# EasyEDA schematic SCH_RE2-YM2608 REV.0.1a_2023-12-15.json

## Sheets
1 OPNA: TITLE: Sheet_1; REV: 1.0; Date: 2023-12-15; Sheet: 1/1; Drawn By: Denjhang; Company: Your Company
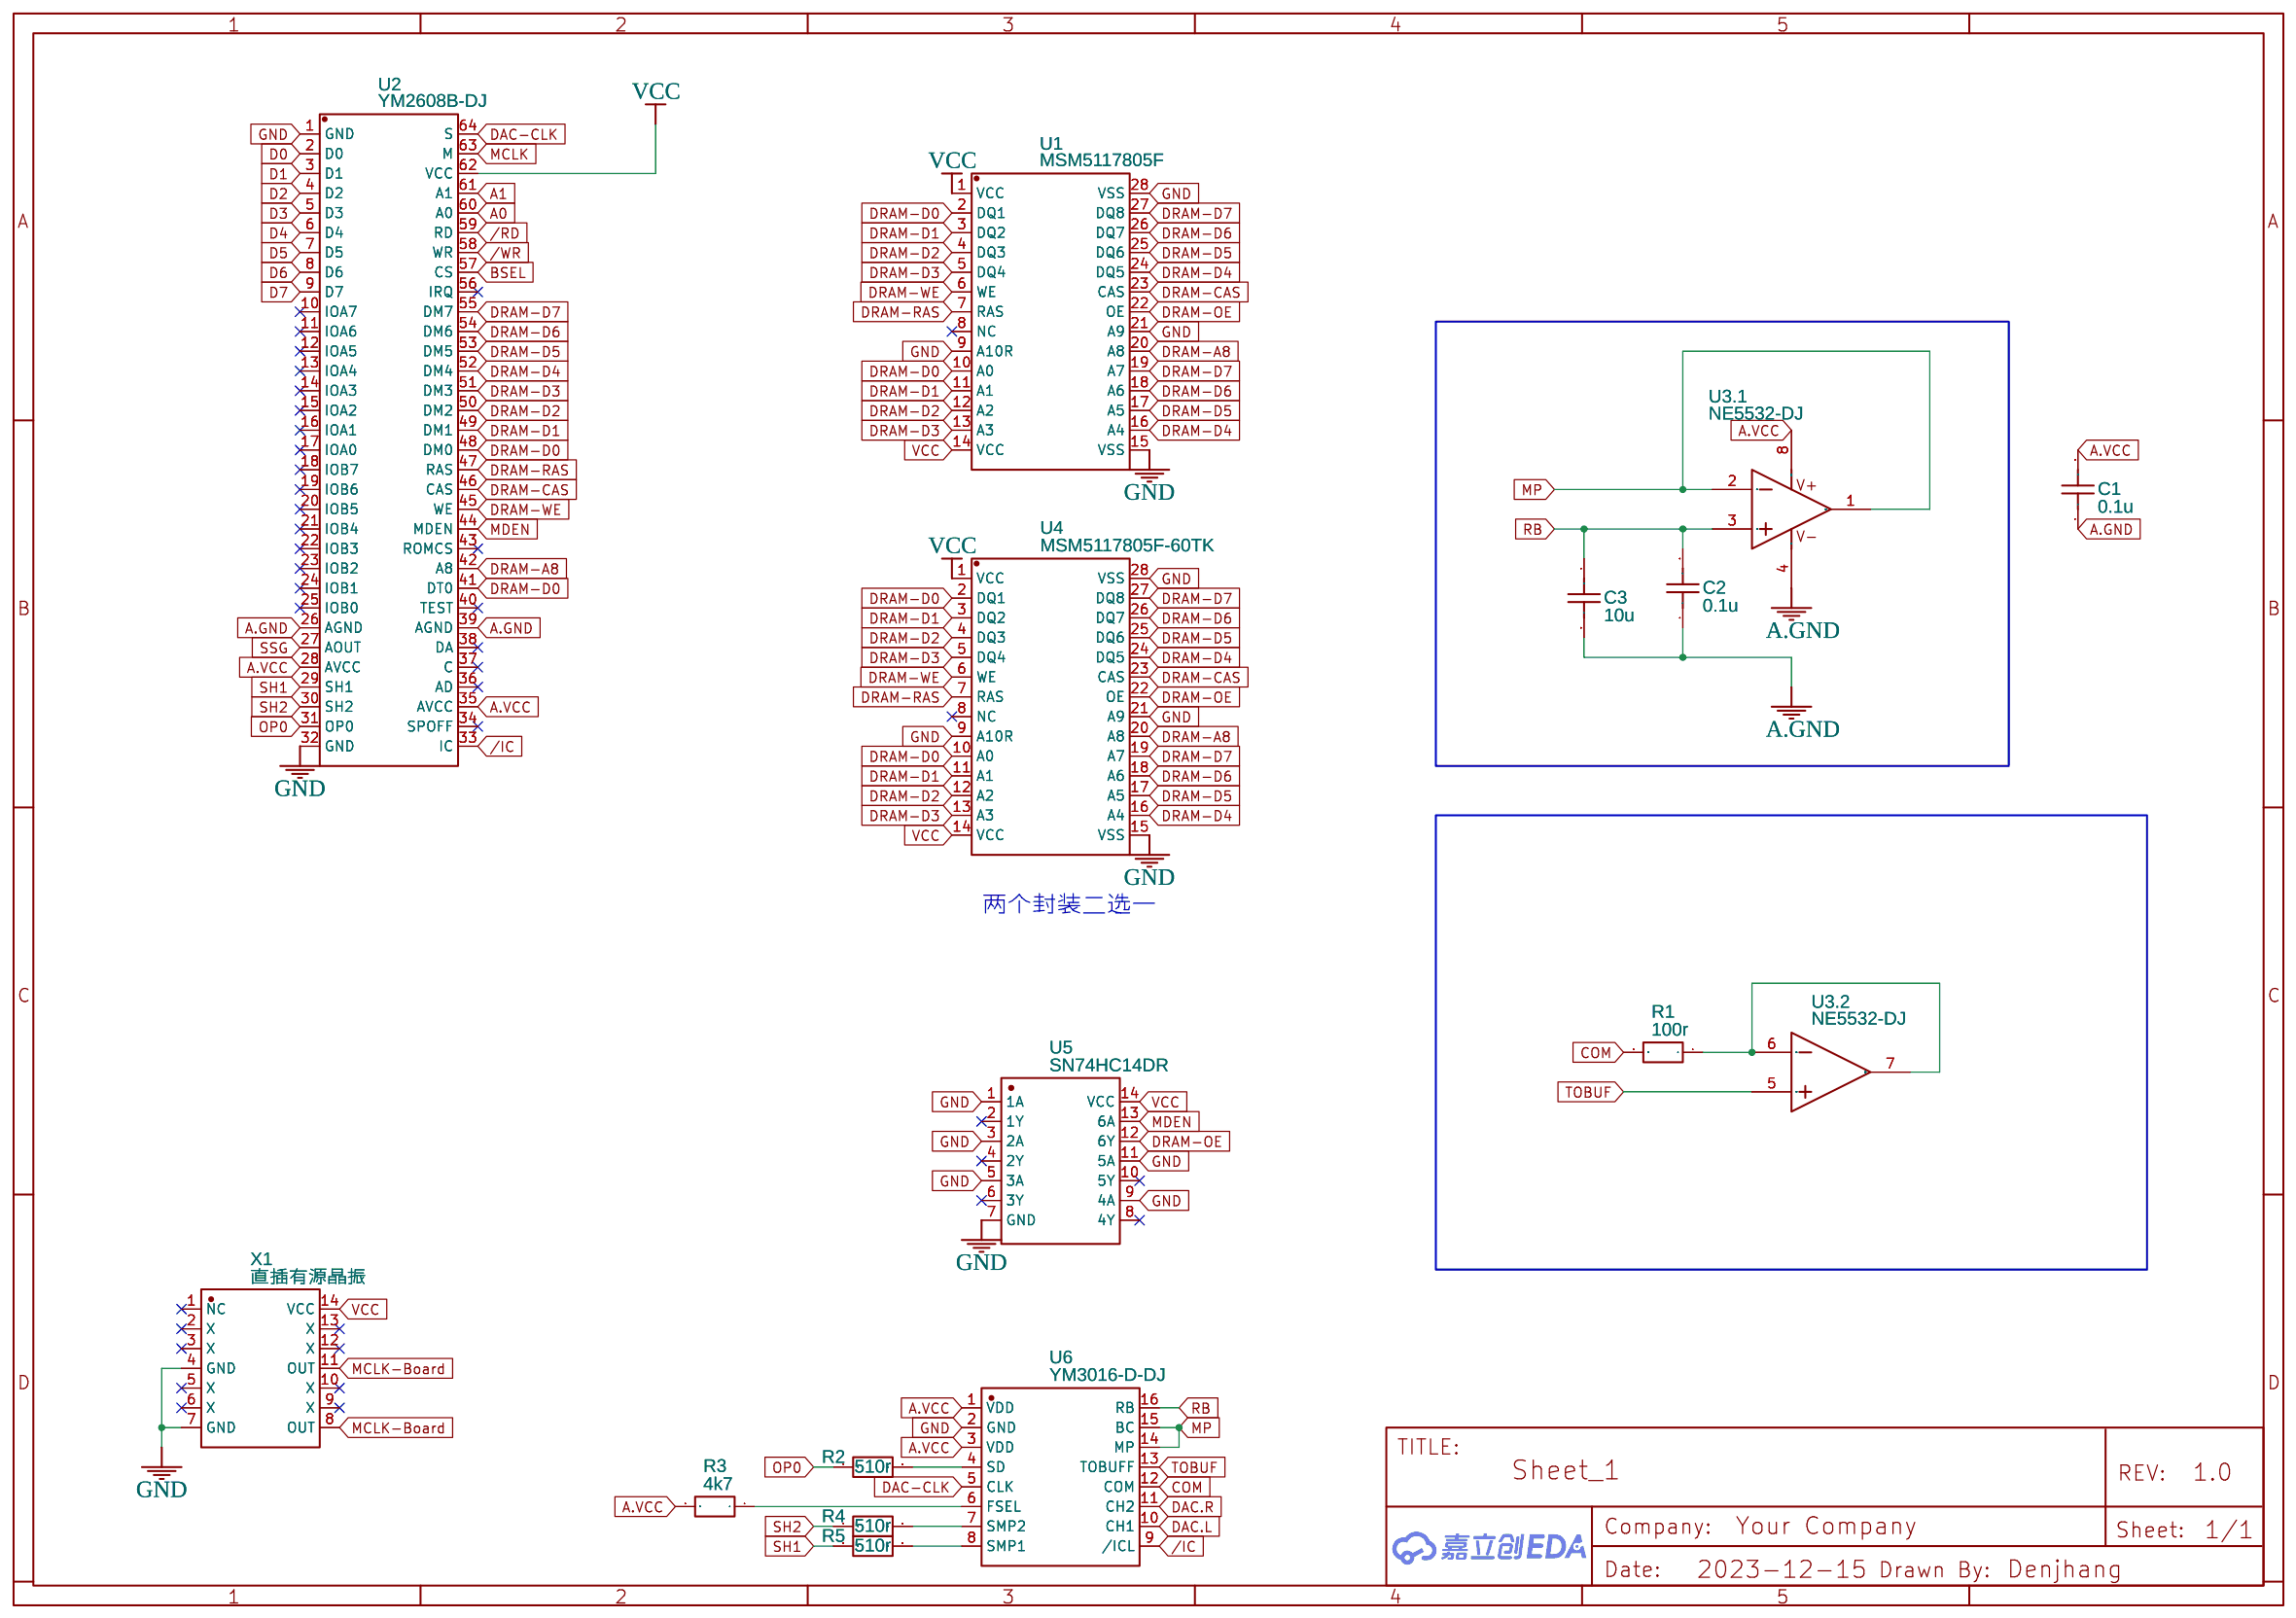
[diagram p0: OPNA]
2 BUS-PSU: TITLE: Sheet_2
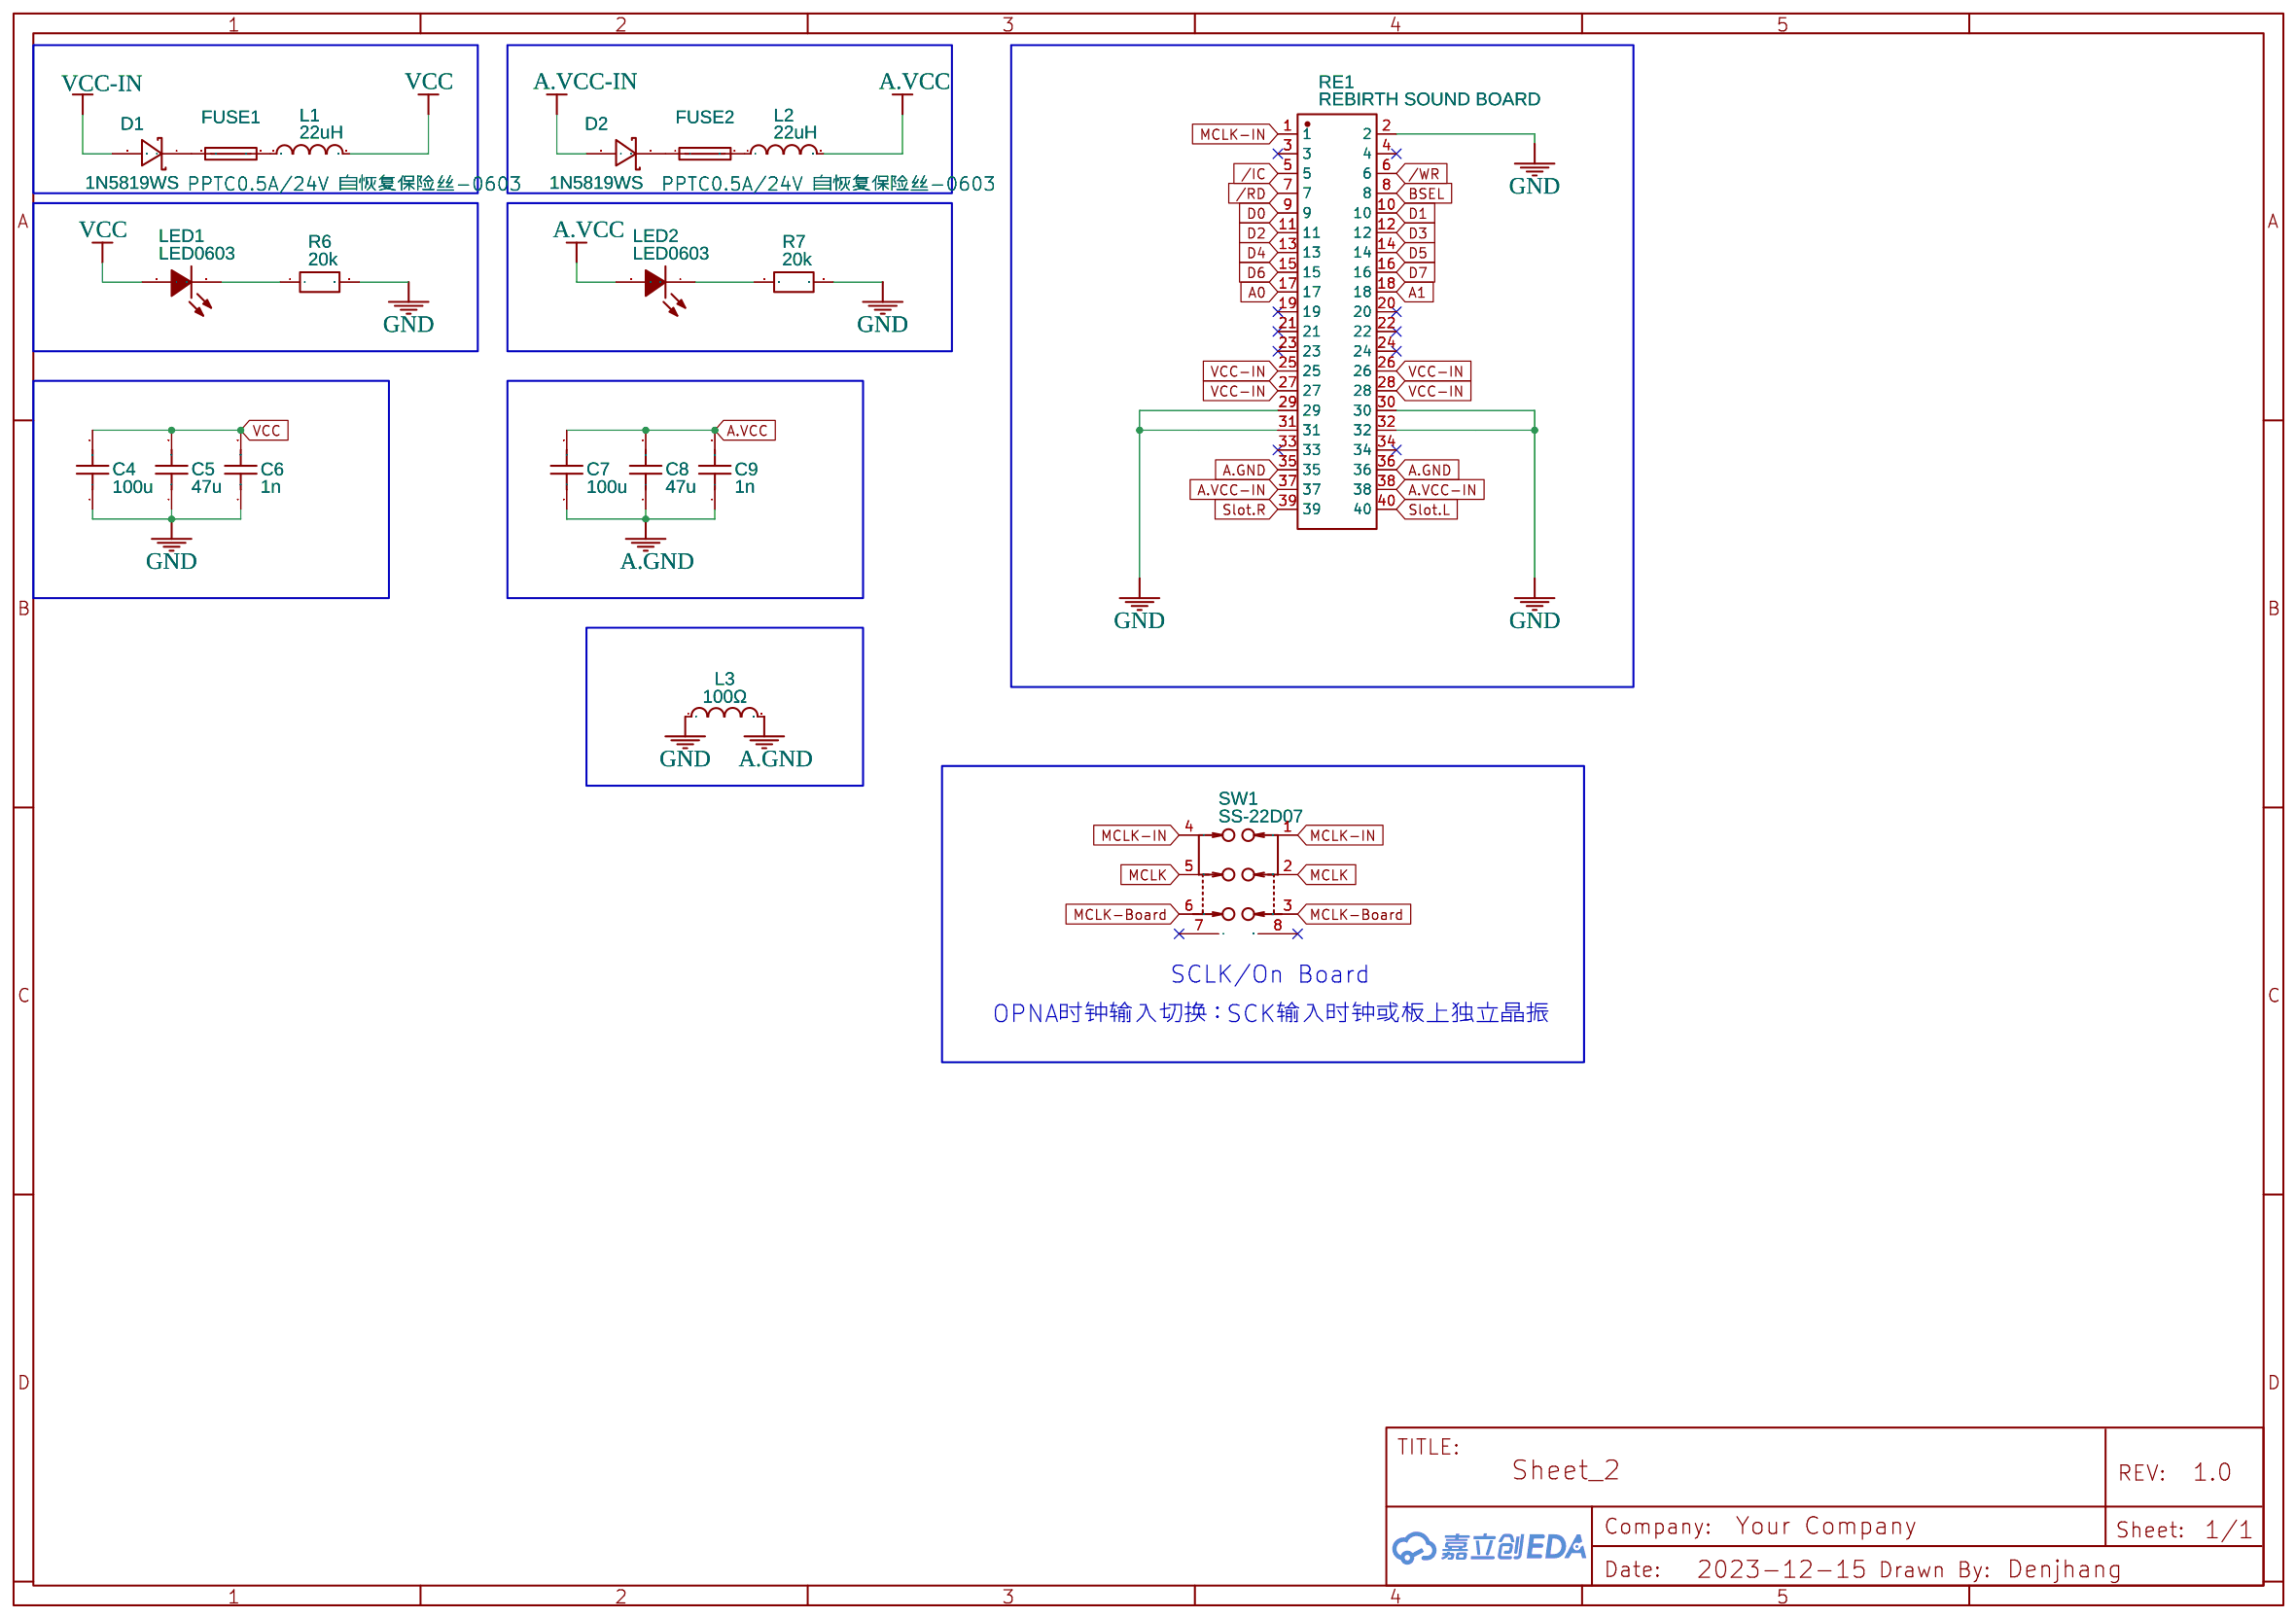
[diagram p1: BUS-PSU]
3 AMP-FM
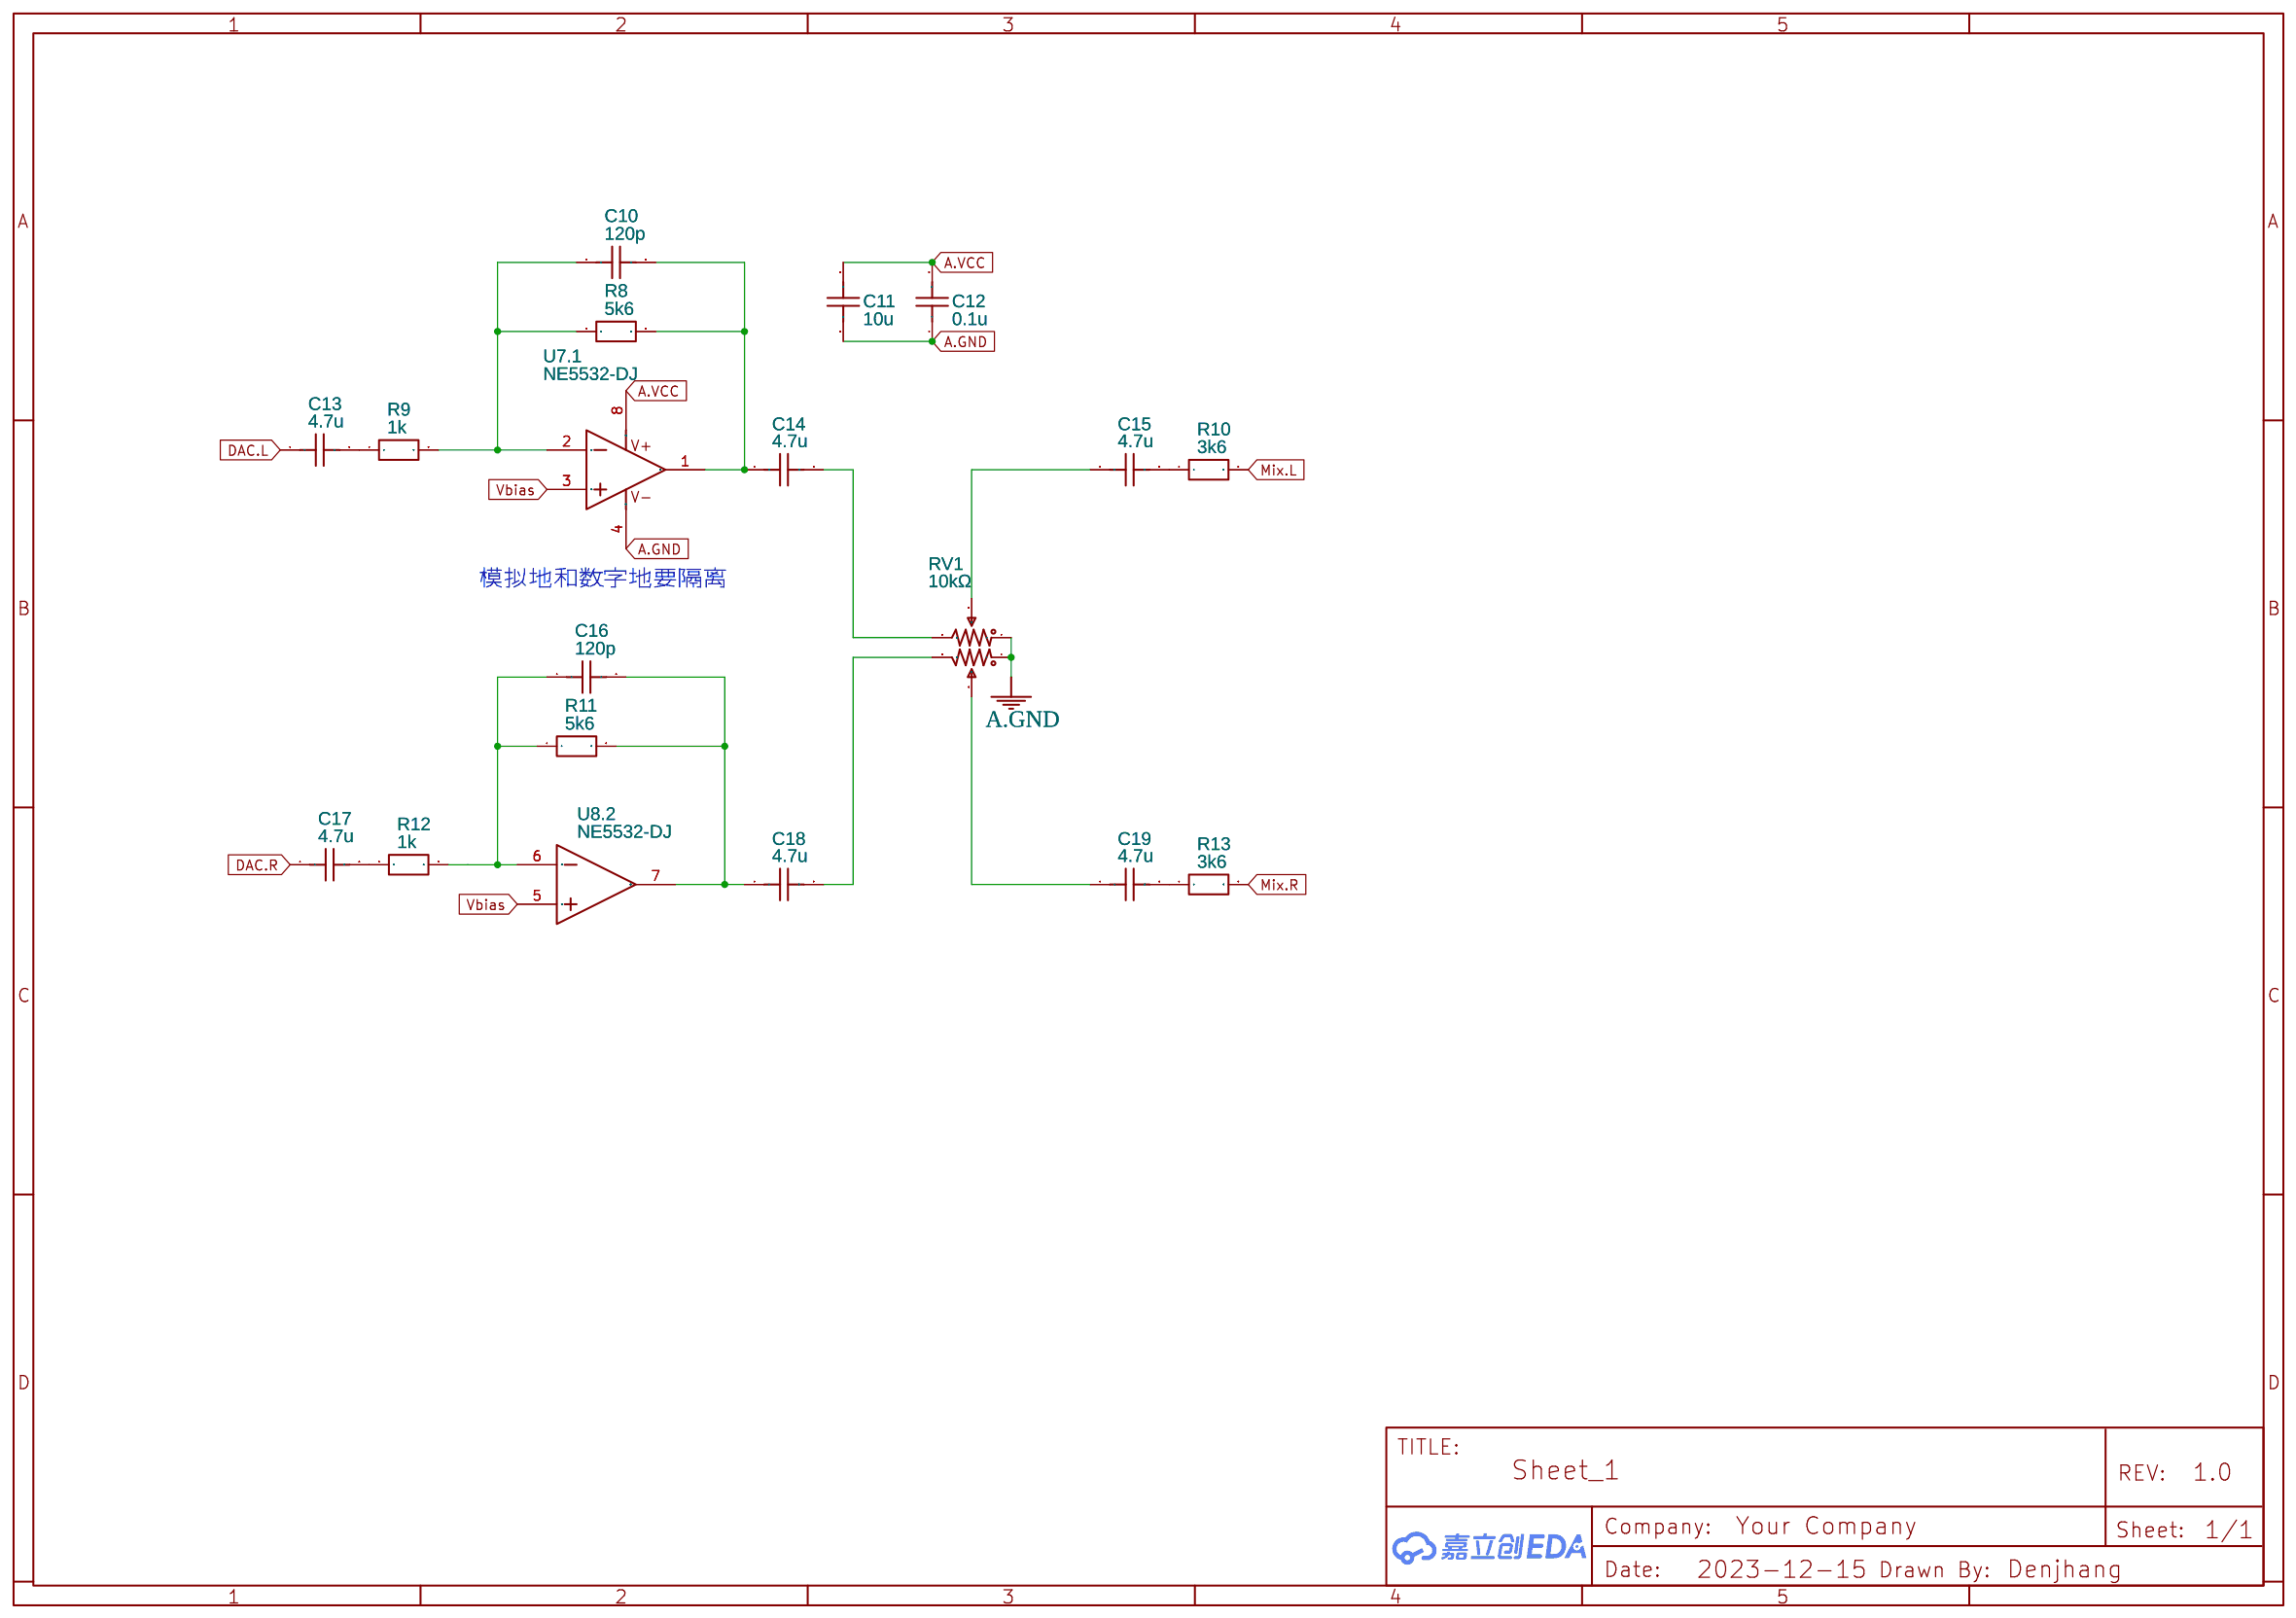
[diagram p2: AMP-FM]
4 AMP-SSG
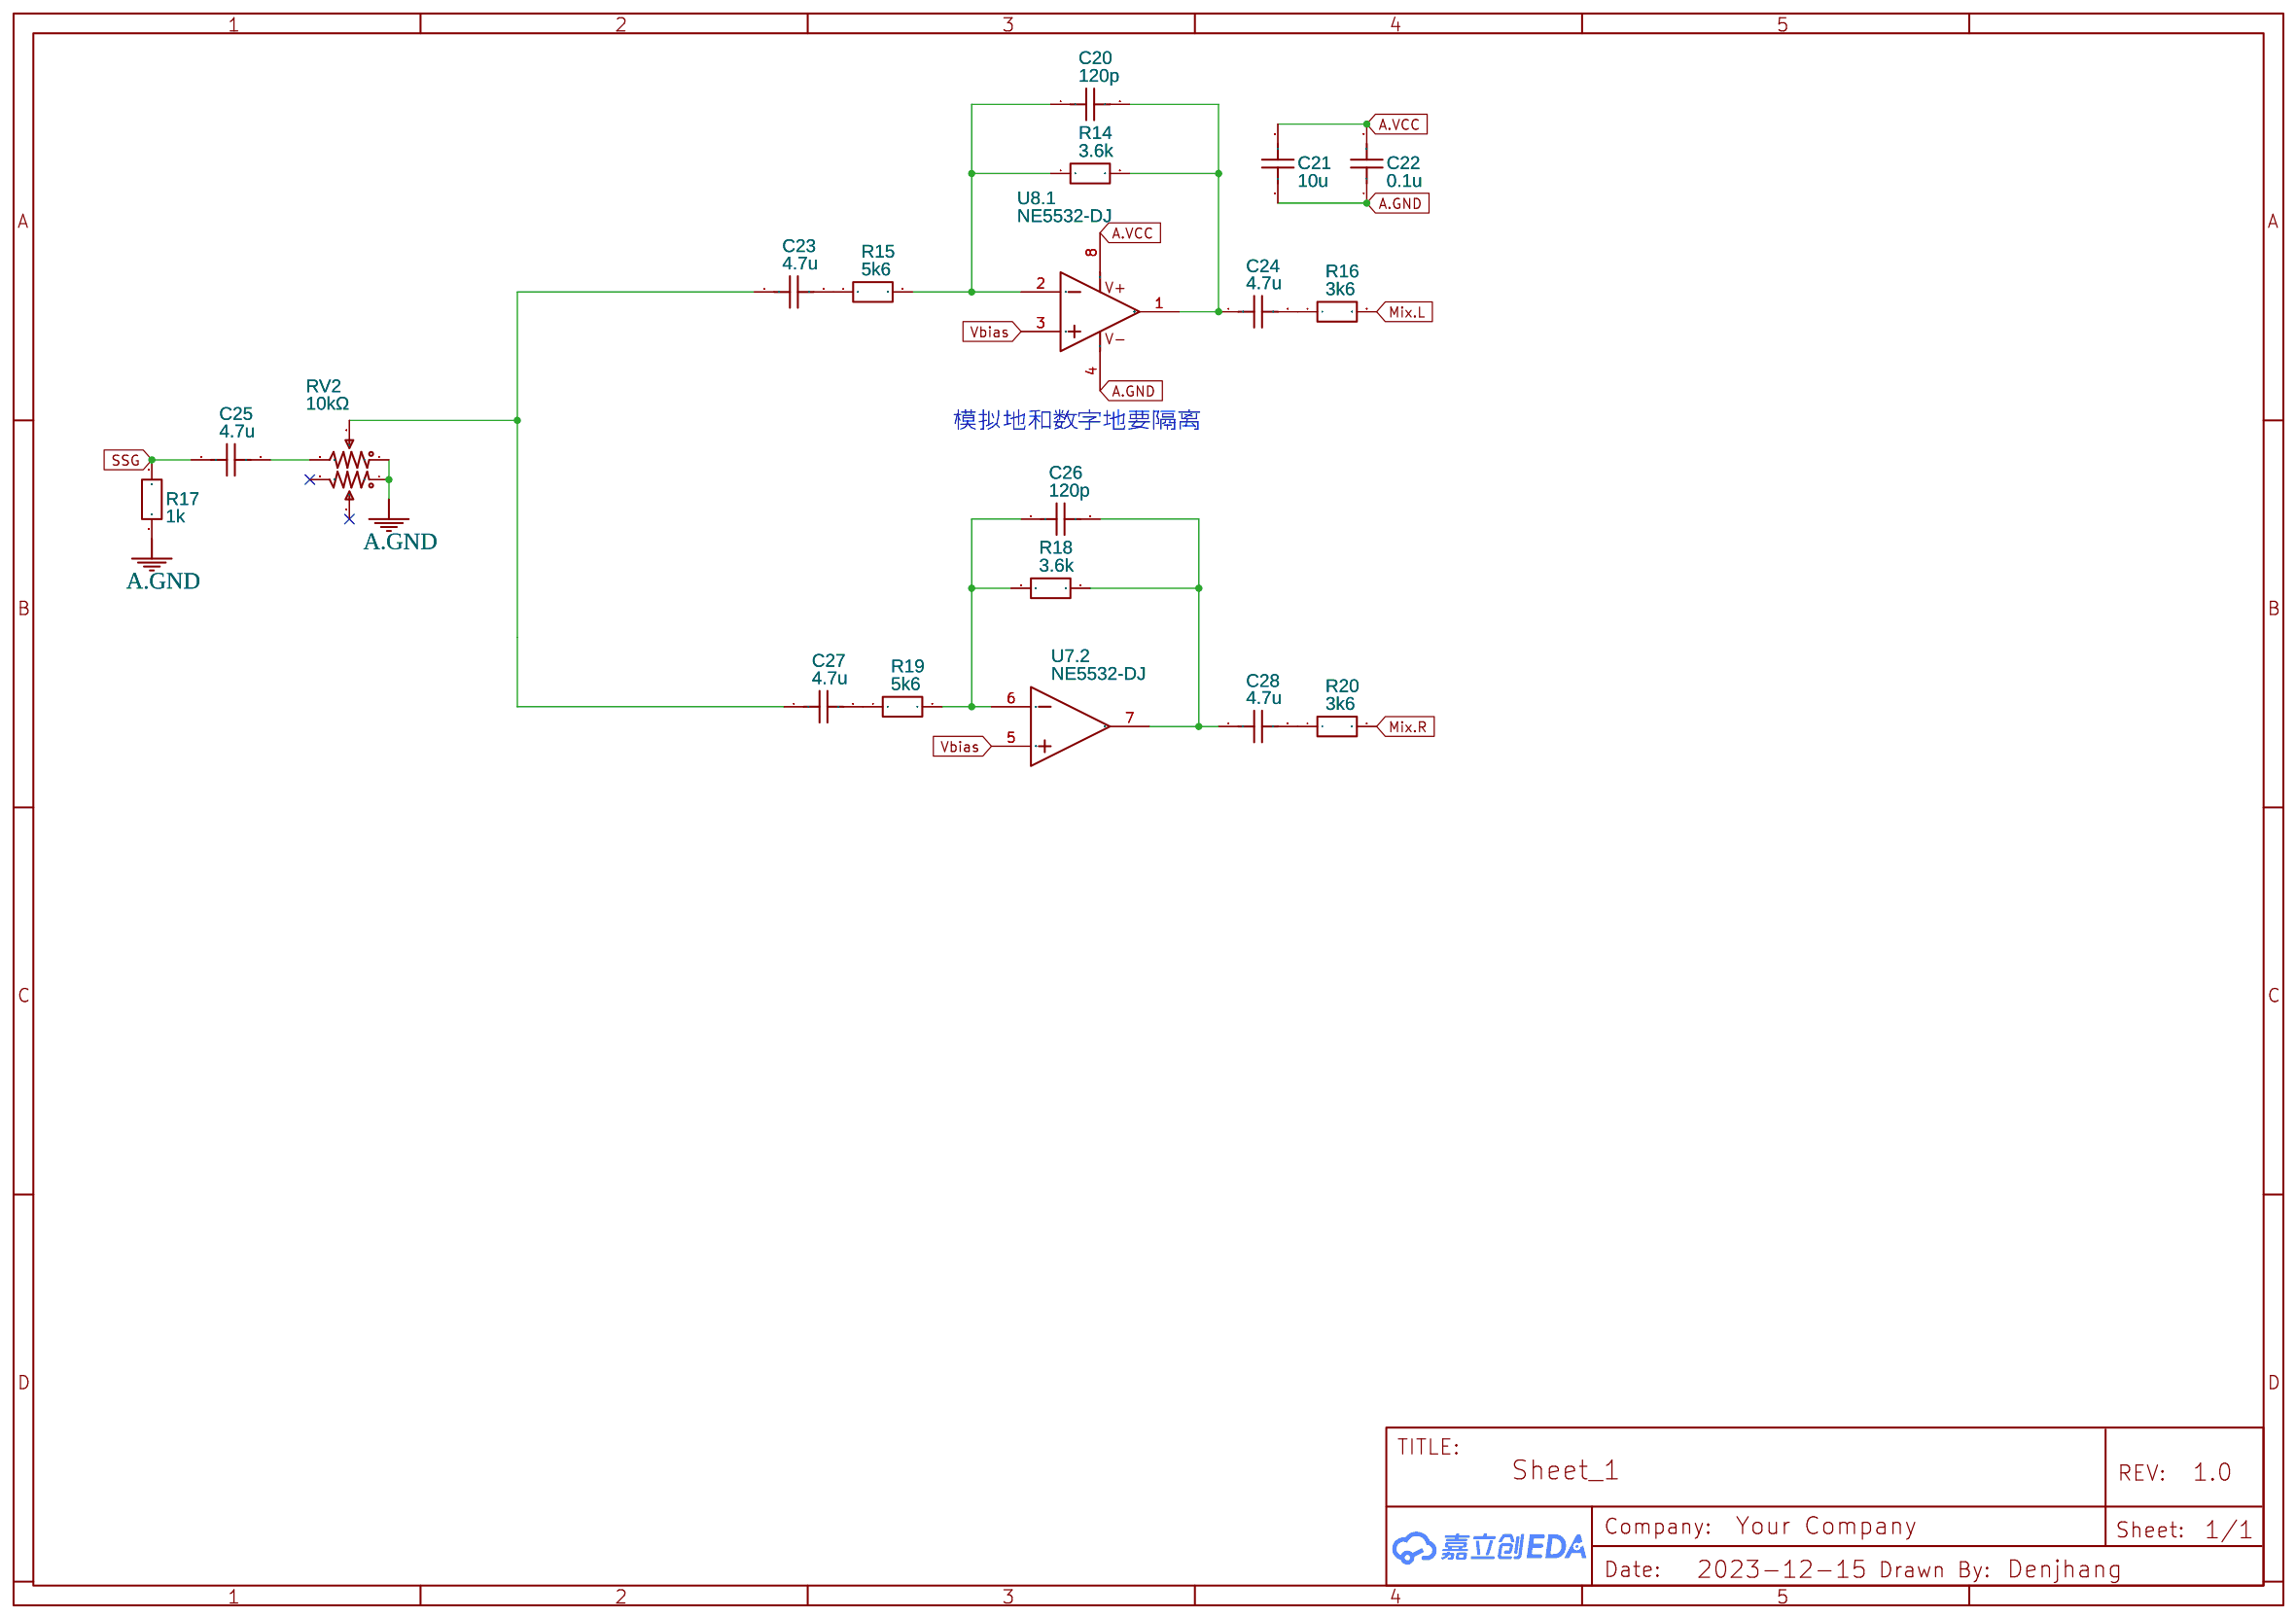
[diagram p3: AMP-SSG]
5 Mixer
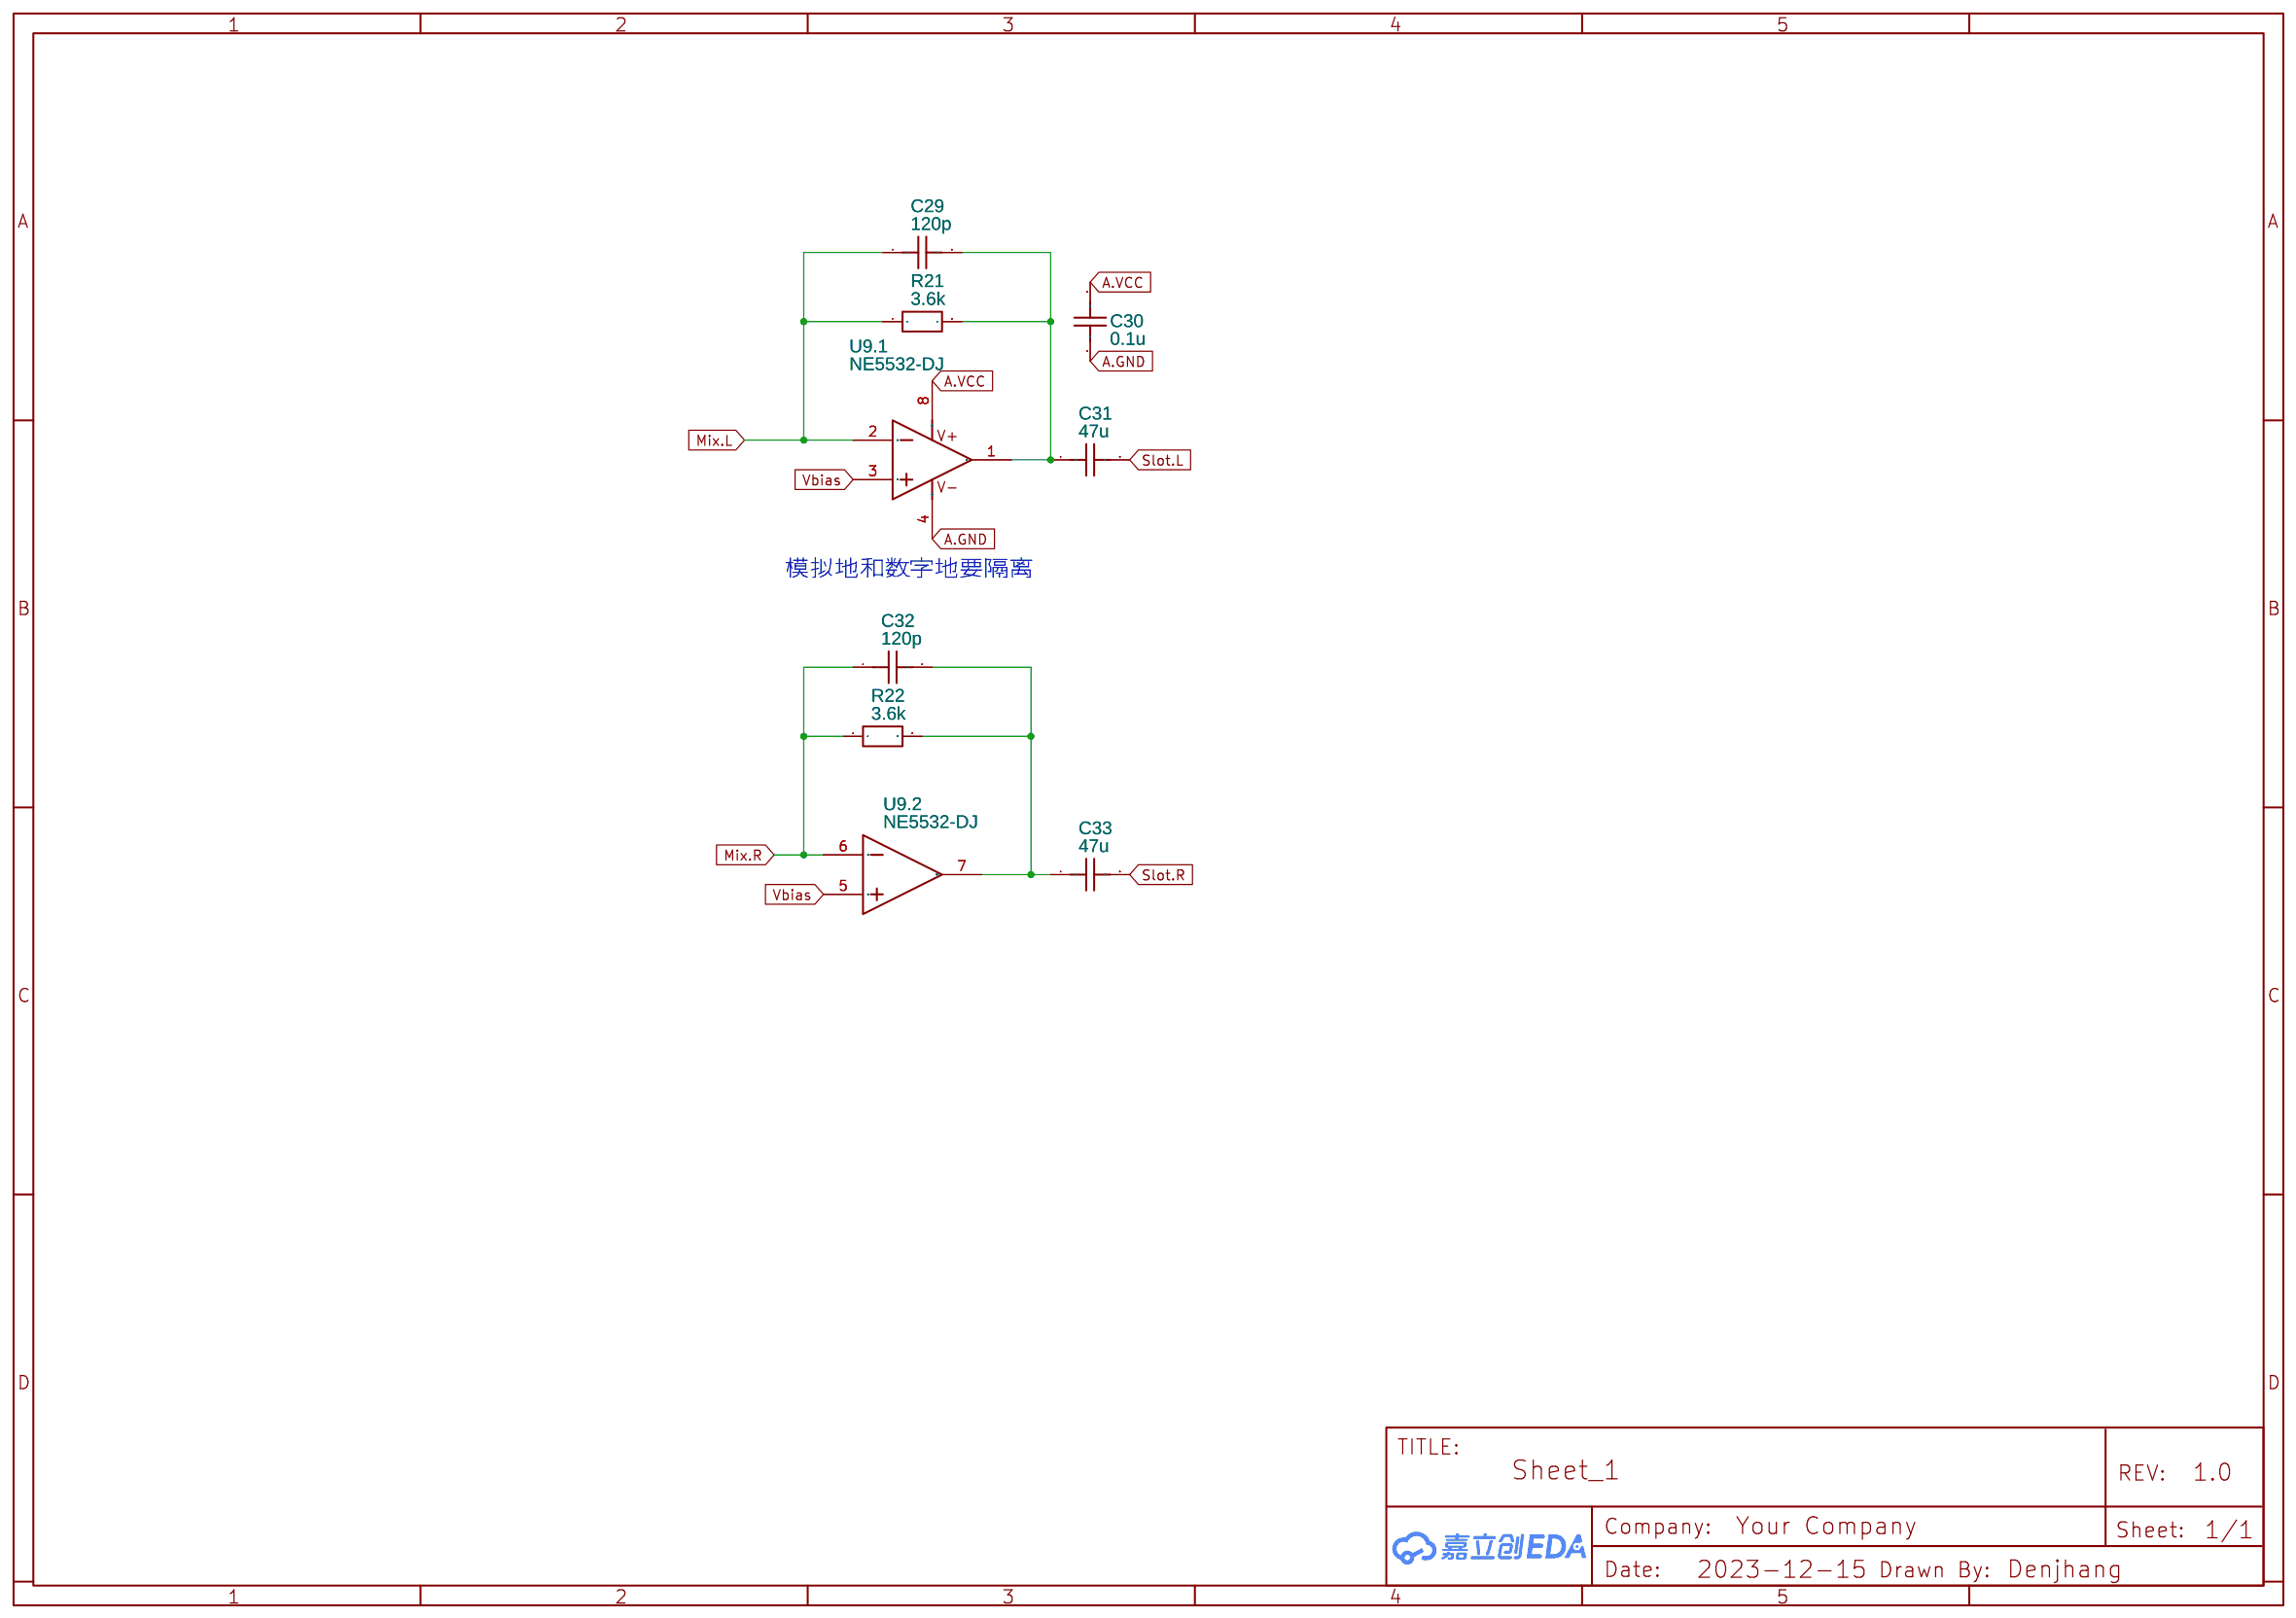
[diagram p4: Mixer]

## Parts
sheet AMP-FM
C10  120p  [C0603]
C11  10u  [C0603]
C12  0.1u  [C0603]
C13  4.7u  [C0603]
C14  4.7u  [C0603]
C15  4.7u  [C0603]
C16  120p  [C0603]
C17  4.7u  [C0603]
C18  4.7u  [C0603]
C19  4.7u  [C0603]
R8  5k6  [R0603]
R9  1k  [R0603]
R10  3k6  [R0603]
R11  5k6  [R0603]
R12  1k  [R0603]
R13  3k6  [R0603]
RV1  10kΩ  [RK097G-DJ]
U7  NE5532-DJ  [DIP-8-DJ]  (sections 1,2)
sheet AMP-SSG
C20  120p  [C0603]
C21  10u  [C0603]
C22  0.1u  [C0603]
C23  4.7u  [C0603]
C24  4.7u  [C0603]
C25  4.7u  [C0603]
C26  120p  [C0603]
C27  4.7u  [C0603]
C28  4.7u  [C0603]
R14  3.6k  [R0603]
R15  5k6  [R0603]
R16  3k6  [R0603]
R17  1k  [R0603]
R18  3.6k  [R0603]
R19  5k6  [R0603]
R20  3k6  [R0603]
RV2  10kΩ  [RK097G-DJ]
U8  NE5532-DJ  [DIP-8-DJ]  (sections 1,2)
sheet BUS-PSU
C4  100u  [C1206]
C5  47u  [C0805]
C6  1n  [C0603]
C7  100u  [C1206]
C8  47u  [C0805]
C9  1n  [C0603]
D1  1N5819WS  [SOD-323_L1.8-W1.3-LS2.5-RD]
D2  1N5819WS  [SOD-323_L1.8-W1.3-LS2.5-RD]
FUSE1  PPTC0.5A/24V 自恢复保险丝-0603  [F0603]
FUSE2  PPTC0.5A/24V 自恢复保险丝-0603  [F0603]
L1  22uH  [IND-SMD_L4.4-W4.0_PHC0420]
L2  22uH  [IND-SMD_L4.4-W4.0_PHC0420]
L3  100Ω  [L0603]
LED1  LED0603  [LED0603-RD]
LED2  LED0603  [LED0603-RD]
R6  20k  [R0603]
R7  20k  [R0603]
RE1  REBIRTH SOUND BOARD  [REBIRTH SOUND BOARD]
SW1  SS-22D07  [SW-TH_SS-22D07]
sheet Mixer
C29  120p  [C0603]
C30  0.1u  [C0603]
C31  47u  [C0805]
C32  120p  [C0603]
C33  47u  [C0805]
R21  3.6k  [R0603]
R22  3.6k  [R0603]
U9  NE5532-DJ  [DIP-8-DJ]  (sections 1,2)
sheet OPNA
C1  0.1u  [C0603]
C2  0.1u  [C0603]
C3  10u  [C0805]
R1  100r  [R0603]
R2  510r  [R0603]
R3  4k7  [R0603]
R4  510r  [R0603]
R5  510r  [R0603]
U1  MSM5117805F  [SOJ-28_300]
U2  YM2608B-DJ  [SDIP64-DJ]
U3  NE5532-DJ  [DIP-8-DJ]  (sections 1,2)
U4  MSM5117805F-60TK  [TSOP28-M5117805F-60TK]
U5  SN74HC14DR  [SOIC-14_L8.7-W3.9-P1.27-LS6.0-BL]
U6  YM3016-D-DJ  [DIP16-DJ]
X1  直插有源晶振  [DIP14-有源晶振]

## Library data of the parts
C1 C2 C6 C9-C30 C32 = C_0603_US: Contributor: LCEDA_Lib
R1-R22 = R_0603_EU: Contributor: LCEDA_Lib
RV1 RV2 = RK097-双连体: Contributor: LCSC; Supplier: LCSC; Supplier Part: C231763; Manufacturer: ALPSALPINE(阿尔卑斯阿尔派); Manufacturer Part: RK09712200MY; JLCPCB Part Class: Extended Part
U3 U7-U9 = NE5532-DJ: tags: Audio Operational Amplifier; Supplier Part: C5326; Supplier: LCSC; Manufacturer: TI; Manufacturer Part: NE5532P; subpart_no: 1; image: http://image.lceda.cn/szlcsc/C5326.jpg; JLCPCB Part Class: Extended Part; Contributor: Denjhang
C4 C7 = C_1206_US: Contributor: LCEDA_Lib
C3 C5 C8 C31 C33 = C_0805_US: Contributor: LCEDA_Lib
D1 D2 = 1N5819WS: Contributor: LCSC; Supplier: LCSC; Supplier Part: C191023; Manufacturer: Hottech(合科泰); JLCPCB Part Class: Basic Part; link: https://so.szlcsc.com/global.html?k=C191023&ref=editor
FUSE1 FUSE2 = PPTC0.5A/24V 自恢复保险丝-0603: Contributor: LCSC; Supplier: LCSC; Supplier Part: C9900007586; Manufacturer: null; JLCPCB Part Class: Extended Part
L1 L2 = APH0420T2R2M: Contributor: lcsc; Supplier: LCSC; Supplier Part: C5349665; Manufacturer: APV(爱普微); JLCPCB Part Class: Extended Part; link: https://so.szlcsc.com/global.html?k=C5349665&ref=editor
L3 = CBW160808U102T: Supplier: LCSC; Manufacturer: FH; Supplier Part: C50069; JLCPCB Part Class: Extended Part
LED1 LED2 = LED0603: Supplier: LCSC; Supplier Part: C2892154; Manufacturer: GBG; Manufacturer Part: GBG-C192KRKT; link: https://atta.szlcsc.comnull; Contributor: Denjhang
RE1 = REBIRTH SOUND BOARD: Contributor: lcsc; Supplier: LCSC; Supplier Part: C5242133; Manufacturer: XKB Connectivity(中国星坤); Manufacturer Part: X6522WR-2x20H-C60D30-E43F03
SW1 = SS-22D07: Supplier Part: C34982; Supplier: LCSC; Manufacturer: ReliaPro; JLCPCB Part Class: Extended Part; link: https://so.szlcsc.com/global.html?k=C34982&ref=editor
U1 = MSM5117805F: Contributor: lizaer012
U2 = YM2608B-DJ: Manufacturer Part: YAMAHA; Contributor: ZengRunMing
U4 = MSM5117805F-60TK: Contributor: lizaer012
U5 = SN74HC14DR: Supplier: LCSC; Manufacturer: TI(德州仪器); Supplier Part: C6820; JLCPCB Part Class: Extended Part; link: https://so.szlcsc.com/global.html?k=C6820&ref=editor
U6 = YM3016-D-DJ: Contributor: 74644323
X1 = 直插有源晶振: Contributor: denjhang

## Nets
GND: C4.1 C5.1 C6.1 L3.1 R6.2 R7.2 RE1.2 RE1.29 RE1.30 RE1.31 RE1.32 U1.9(A10R) U1.15(VSS) U1.21(A9) U1.28(VSS) U2.1(GND) U2.32(GND) U4.9(A10R) U4.15(VSS) U4.21(A9) U4.28(VSS) U5.1(1A) U5.3(2A) U5.5(3A) U5.7(GND) U5.9(4A) U5.11(5A) U6.2(GND) X1.4(GND) X1.7(GND)
VCC: C4.2 C5.2 C6.2 L1.2 LED1.2(A) U1.1(VCC) U1.14(VCC) U2.62(VCC) U4.1(VCC) U4.14(VCC) U5.14(VCC) X1.14(VCC)
VCC-IN: D1.2(A) RE1.25 RE1.26 RE1.27 RE1.28
/IC: RE1.5 U2.33(IC) U6.9(/ICL)
/RD: RE1.7 U2.59(RD)
/WR: RE1.6 U2.58(WR)
A0: RE1.17 U2.60(A0)
A1: RE1.18 U2.61(A1)
A.GND: C1.1 C2.1 C3.2 C7.1 C8.1 C9.1 C11.1 C12.1 C21.1 C22.1 C30.1 L3.2 R17.1 RE1.35 RE1.36 RV1.1 RV1.4 RV2.1 RV2.4 U2.26(AGND) U2.39(AGND) U3.4(VCC-) U7.4(VCC-) U8.4(VCC-) U9.4(VCC-)
A.VCC: C1.2 C7.2 C8.2 C9.2 C11.2 C12.2 C21.2 C22.2 C30.2 L2.2 LED2.2(A) R3.2 U2.28(AVCC) U2.35(AVCC) U3.8(VCC+) U6.1(VDD) U6.3(VDD) U7.8(VCC+) U8.8(VCC+) U9.8(VCC+)
A.VCC-IN: D2.2(A) RE1.37 RE1.38
BSEL: RE1.8 U2.57(CS)
COM: R1.2 U6.12(COM)
D0: RE1.9 U2.2(D0)
D1: RE1.10 U2.3(D1)
D2: RE1.11 U2.4(D2)
D3: RE1.12 U2.5(D3)
D4: RE1.13 U2.6(D4)
D5: RE1.14 U2.7(D5)
D6: RE1.15 U2.8(D6)
D7: RE1.16 U2.9(D7)
DAC-CLK: U2.64(S) U6.5(CLK)
DAC.L: C13.1 U6.10(CH1)
DAC.R: C17.1 U6.11(CH2)
DRAM-A8: U1.20(A8) U2.42(A8) U4.20(A8)
DRAM-CAS: U1.23(CAS) U2.46(CAS) U4.23(CAS)
DRAM-D0: U1.2(DQ1) U1.10(A0) U2.41(DT0) U2.48(DM0) U4.2(DQ1) U4.10(A0)
DRAM-D1: U1.3(DQ2) U1.11(A1) U2.49(DM1) U4.3(DQ2) U4.11(A1)
DRAM-D2: U1.4(DQ3) U1.12(A2) U2.50(DM2) U4.4(DQ3) U4.12(A2)
DRAM-D3: U1.5(DQ4) U1.13(A3) U2.51(DM3) U4.5(DQ4) U4.13(A3)
DRAM-D4: U1.16(A4) U1.24(DQ5) U2.52(DM4) U4.16(A4) U4.24(DQ5)
DRAM-D5: U1.17(A5) U1.25(DQ6) U2.53(DM5) U4.17(A5) U4.25(DQ6)
DRAM-D6: U1.18(A6) U1.26(DQ7) U2.54(DM6) U4.18(A6) U4.26(DQ7)
DRAM-D7: U1.19(A7) U1.27(DQ8) U2.55(DM7) U4.19(A7) U4.27(DQ8)
DRAM-OE: U1.22(OE) U4.22(OE) U5.12(6Y)
DRAM-RAS: U1.7(RAS) U2.47(RAS) U4.7(RAS)
DRAM-WE: U1.6(WE) U2.45(WE) U4.6(WE)
MCLK: SW1.2 SW1.5 U2.63(M)
MCLK-Board: SW1.3 SW1.6 X1.8(OUT) X1.11(OUT)
MCLK-IN: RE1.1 SW1.1 SW1.4
MDEN: U2.44(MDEN) U5.13(6A)
Mix.L: C29.1 R10.2 R16.2 R21.1 U9.2(IN1-)
Mix.R: C32.1 R13.2 R20.2 R22.1 U9.6(IN2-)
MP: U3.1(OUT1) U3.2(IN1-) U6.14(MP) U6.15(BC)
OP0: R2.1 U2.31(OP0)
RB: C2.2 C3.1 U3.3(IN1+) U6.16(RB)
SH1: R5.1 U2.29(SH1)
SH2: R4.1 U2.30(SH2)
Slot.L: C31.2 RE1.40
Slot.R: C33.2 RE1.39
SSG: C25.1 R17.2 U2.27(AOUT)
TOBUF: U3.5(IN2+) U6.13(TOBUFF)
Vbias: U7.3(IN1+) U7.5(IN2+) U8.3(IN1+) U8.5(IN2+) U9.3(IN1+) U9.5(IN2+)
Net-(C10-1): C10.1 R8.1 R9.2 U7.2(IN1-)
Net-(C10-2): C10.2 C14.1 R8.2 U7.1(OUT1)
Net-(C13-2): C13.2 R9.1
Net-(C14-2): C14.2 RV1.3
Net-(C15-1): C15.1 RV1.2
Net-(C15-2): C15.2 R10.1
Net-(C16-1): C16.1 R11.1 R12.2 U8.6(IN2-)
Net-(C16-2): C16.2 C18.1 R11.2 U8.7(OUT2)
Net-(C17-2): C17.2 R12.1
Net-(C18-2): C18.2 RV1.6
Net-(C19-1): C19.1 RV1.5
Net-(C19-2): C19.2 R13.1
Net-(C20-1): C20.1 R14.1 R15.2 U8.2(IN1-)
Net-(C20-2): C20.2 C24.1 R14.2 U8.1(OUT1)
Net-(C23-1): C23.1 C27.1 RV2.2
Net-(C23-2): C23.2 R15.1
Net-(C24-2): C24.2 R16.1
Net-(C25-2): C25.2 RV2.3
Net-(C26-1): C26.1 R18.1 R19.2 U7.6(IN2-)
Net-(C26-2): C26.2 C28.1 R18.2 U7.7(OUT2)
Net-(C27-2): C27.2 R19.1
Net-(C28-2): C28.2 R20.1
Net-(C29-2): C29.2 C31.1 R21.2 U9.1(OUT1)
Net-(C32-2): C32.2 C33.1 R22.2 U9.7(OUT2)
Net-(D1-1): D1.1(K) FUSE1.1
Net-(D2-1): D2.1(K) FUSE2.1
Net-(FUSE1-2): FUSE1.2 L1.1
Net-(FUSE2-2): FUSE2.2 L2.1
Net-(LED1-1): LED1.1(C) R6.1
Net-(LED2-1): LED2.1(C) R7.1
Net-(R1-1): R1.1 U3.6(IN2-) U3.7(OUT2)
Net-(R2-2): R2.2 U6.4(SD)
Net-(R3-1): R3.1 U6.6(FSEL)
Net-(R4-2): R4.2 U6.7(SMP2)
Net-(R5-2): R5.2 U6.8(SMP1)

Not connected (* = marked no-connect by the designer): RE1 3* 4* 19* 20* 21* 22* 23* 24* 33* 34*; RV2 5* 6*; SW1 7* 8*; U1 8(NC)*; U2 10(IOA7)* 11(IOA6)* 12(IOA5)* 13(IOA4)* 14(IOA3)* 15(IOA2)* 16(IOA1)* 17(IOA0)* 18(IOB7)* 19(IOB6)* 20(IOB5)* 21(IOB4)* 22(IOB3)* 23(IOB2)* 24(IOB1)* 25(IOB0)* 34(SPOFF)* 36(AD)* 37(C)* 38(DA)* 40(TEST)* 43(ROMCS)* 56(IRQ)*; U4 8(NC)*; U5 2(1Y)* 4(2Y)* 6(3Y)* 8(4Y)* 10(5Y)*; X1 1(NC)* 2(X)* 3(X)* 5(X)* 6(X)* 9(X)* 10(X)* 12(X)* 13(X)*

## Notes on the sheets
sheet 1
- 两个封装二选一
sheet 2
- SCLK/On Board
- OPNA时钟输入切换：SCK输入时钟或板上独立晶振
sheet 3
- 模拟地和数字地要隔离
sheet 4
- 模拟地和数字地要隔离
sheet 5
- 模拟地和数字地要隔离
